# EAGLE schematic rgb_led_watch 2 (EAGLE 6.5.0)
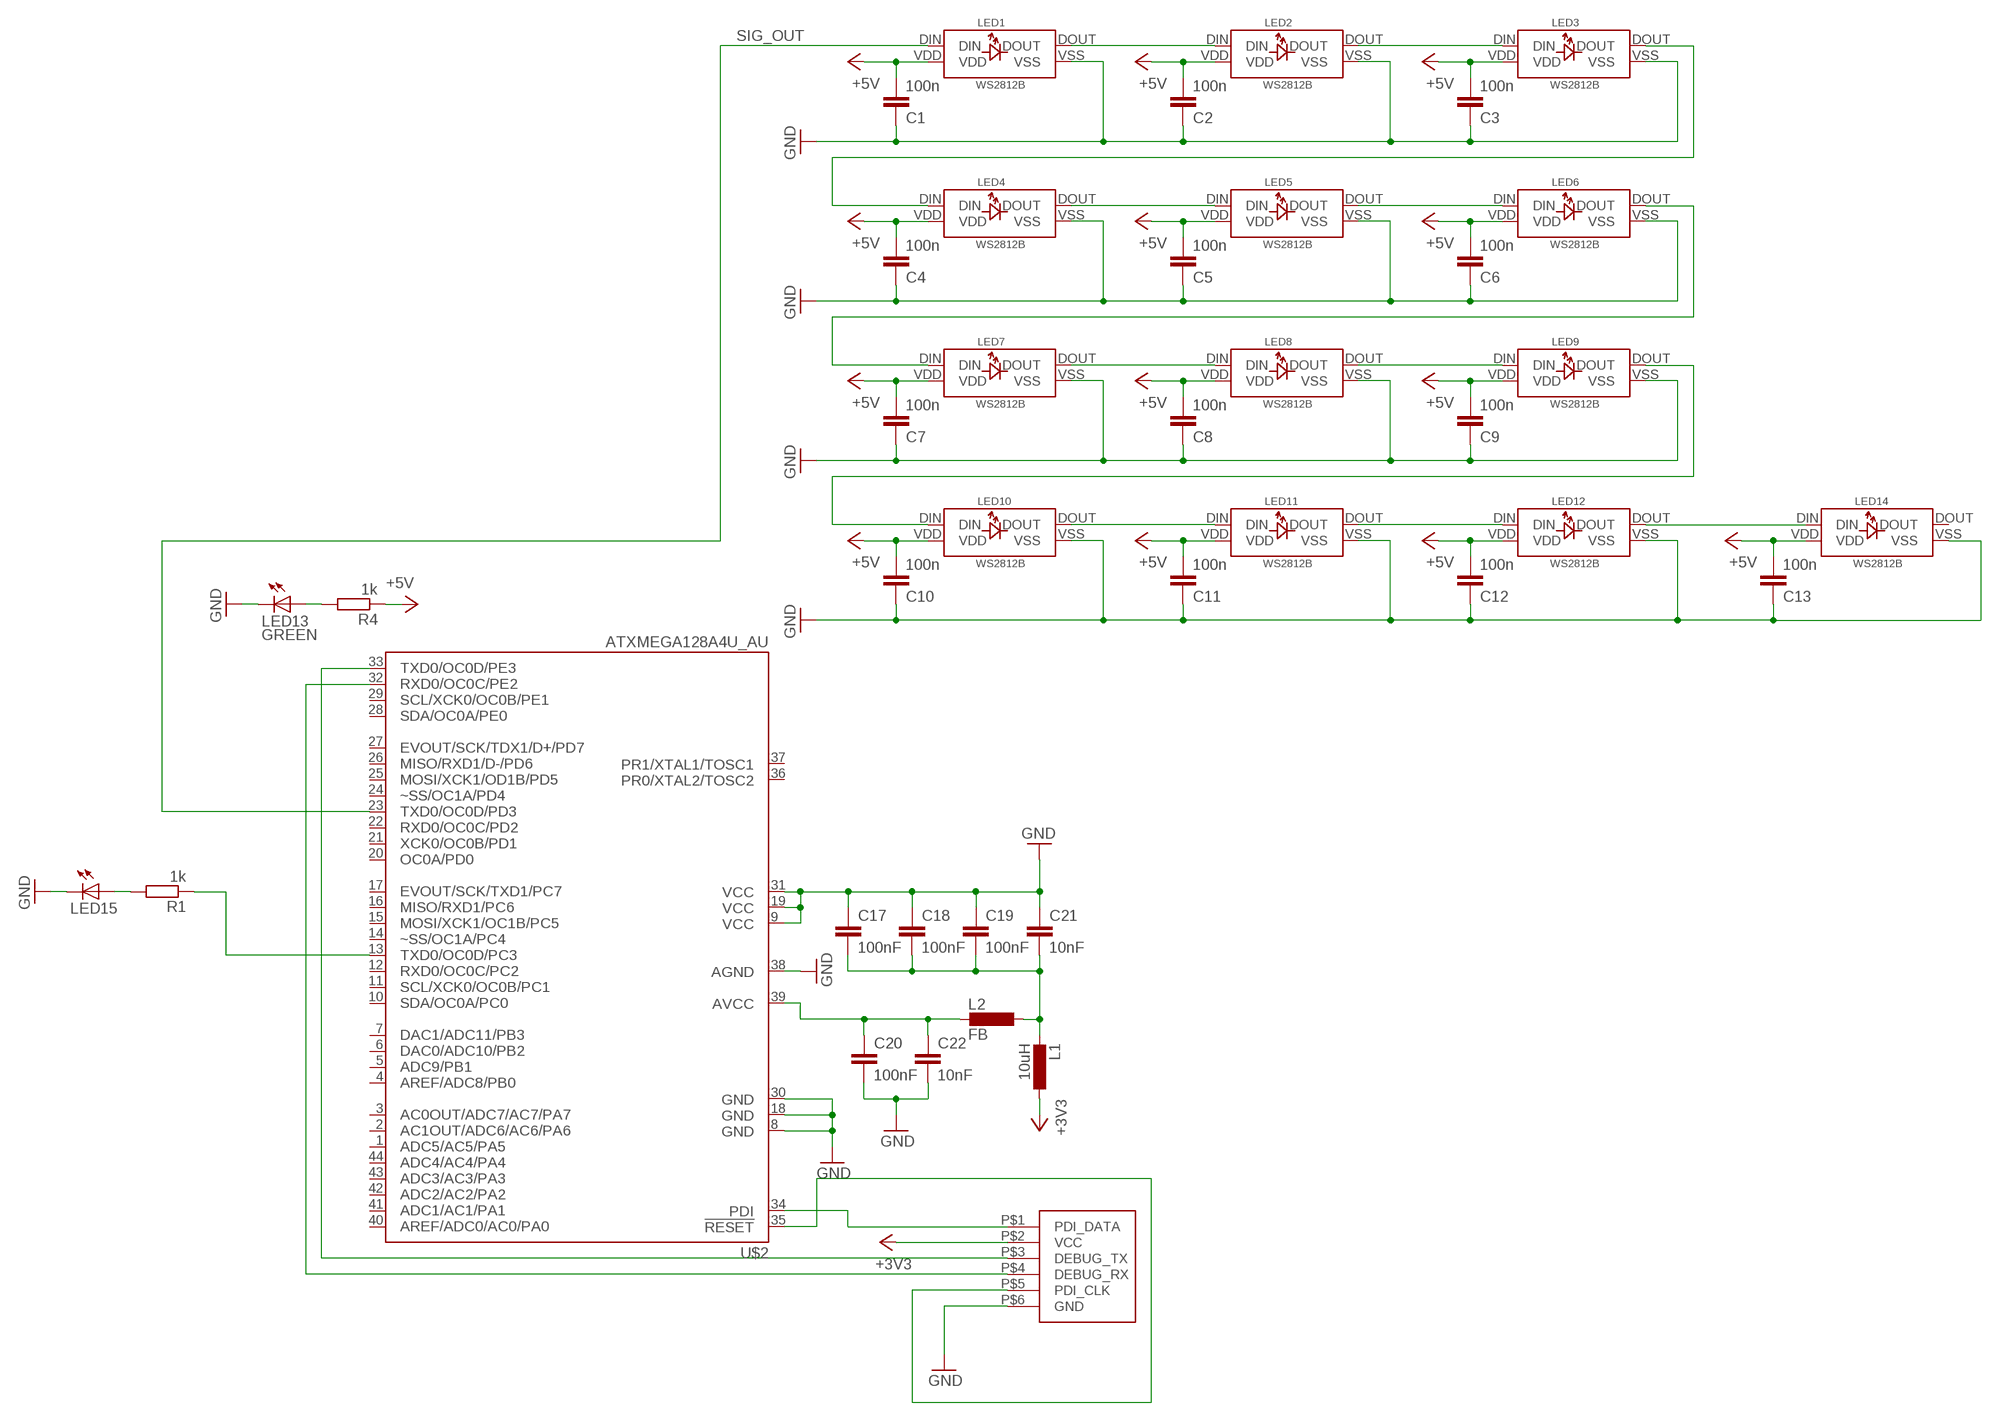
[diagram p0: schematic, sheet 1]

## Parts
C1  100n  C-EUC0603  [C0603]
C2  100n  C-EUC0603  [C0603]
C3  100n  C-EUC0603  [C0603]
C4  100n  C-EUC0603  [C0603]
C5  100n  C-EUC0603  [C0603]
C6  100n  C-EUC0603  [C0603]
C7  100n  C-EUC0603  [C0603]
C8  100n  C-EUC0603  [C0603]
C9  100n  C-EUC0603  [C0603]
C10  100n  C-EUC0603  [C0603]
C11  100n  C-EUC0603  [C0603]
C12  100n  C-EUC0603  [C0603]
C13  100n  C-EUC0603  [C0603]
C17  100nF  C-EUC0306  [C0306]
C18  100nF  C-EUC0306  [C0306]
C19  100nF  C-EUC0306  [C0306]
C20  100nF  C-EUC0306  [C0306]
C21  10nF  C-EUC0805  [C0805]
C22  10nF  C-EUC0805  [C0805]
L1  10uH  L-EUSMD0805  [R0805]
L2  FB  L-EUSMD0603  [R0603]
LED1  WS2812B  [WS2812B]
LED2  WS2812B  [WS2812B]
LED3  WS2812B  [WS2812B]
LED4  WS2812B  [WS2812B]
LED5  WS2812B  [WS2812B]
LED6  WS2812B  [WS2812B]
LED7  WS2812B  [WS2812B]
LED8  WS2812B  [WS2812B]
LED9  WS2812B  [WS2812B]
LED10  WS2812B  [WS2812B]
LED11  WS2812B  [WS2812B]
LED12  WS2812B  [WS2812B]
LED13  GREEN  LEDCHIPLED_0603  [CHIPLED_0603]
LED14  WS2812B  [WS2812B]
LED15  LED5MM  [LED5MM]
R1  1k  R-EU_R0603  [R0603]
R4  1k  R-EU_R0603  [R0603]
U$1  CON_PROG-6CORN  [SMD-6-CORNER]
U$2  ATXMEGA128A4U_AU  [TQFP44]

## Nets
+3V3: L1.1 U$1.P$2(VCC)
+5V: C1.2 C2.2 C3.2 C4.2 C5.2 C6.2 C7.2 C8.2 C9.2 C10.2 C11.2 C12.2 C13.2 LED1.VDD LED2.VDD LED3.VDD LED4.VDD LED5.VDD LED6.VDD LED7.VDD LED8.VDD LED9.VDD LED10.VDD LED11.VDD LED12.VDD LED14.VDD R4.1
GND: C1.1 C2.1 C3.1 C4.1 C5.1 C6.1 C7.1 C8.1 C9.1 C10.1 C11.1 C12.1 C13.1 C17.1 C18.1 C19.1 C20.2 C21.1 C22.2 LED1.VSS LED2.VSS LED3.VSS LED4.VSS LED5.VSS LED6.VSS LED7.VSS LED8.VSS LED9.VSS LED10.VSS LED11.VSS LED12.VSS LED13.C LED14.VSS LED15.K(C) U$1.P$6(GND) U$2.8(GND1) U$2.9(VCC1) U$2.18(GND2) U$2.19(VCC2) U$2.30(GND3) U$2.31(VCC3) U$2.38(AGND)
LED1: LED6.DOUT LED7.DIN
LED2: LED9.DOUT LED10.DIN
LED3: LED3.DOUT LED4.DIN
N$1: C17.2 C18.2 C19.2 C21.2 L1.2 L2.1
N$2: LED13.A R4.2
N$3: LED1.DOUT LED2.DIN
N$4: LED4.DOUT LED5.DIN
N$5: LED2.DOUT LED3.DIN
N$6: LED5.DOUT LED6.DIN
N$7: LED7.DOUT LED8.DIN
N$8: LED8.DOUT LED9.DIN
N$9: LED10.DOUT LED11.DIN
N$10: LED11.DOUT LED12.DIN
N$11: C20.1 C22.1 L2.2 U$2.39(AVCC)
N$12: U$1.P$1(PDI_DATA) U$2.34(PDI_DATA)
N$13: U$1.P$3(DEBUG_TX) U$2.33(PE3)
N$14: U$1.P$4(DEBUG_RX) U$2.32(PE2)
N$15: U$1.P$5(PDI_CLK) U$2.35(RESET)
N$16: LED12.DOUT LED14.DIN
N$18: LED15.A R1.2
N$19: R1.1 U$2.13(PC3)
SIG_OUT: LED1.DIN U$2.23(PD3)
Unconnected: LED14.DOUT U$2.1(PA5) U$2.2(PA6) U$2.3(PA7) U$2.4(PB0) U$2.5(PB1) U$2.6(PB2) U$2.7(PB3) U$2.10(PC0) U$2.11(PC1) U$2.12(PC2) U$2.14(PC4) U$2.15(PC5) U$2.16(PC6) U$2.17(PC7) U$2.20(PD0) U$2.21(PD1) U$2.22(PD2) U$2.24(PD4) U$2.25(PD5) U$2.26(PD6) U$2.27(PD7) U$2.28(PE0) U$2.29(PE1) U$2.36(PR0) U$2.37(PR1) U$2.40(PA0) U$2.41(PA1) U$2.42(PA2) U$2.43(PA3) U$2.44(PA4)

## Library data of the parts
C1-C13 = resistor:C-EU: CAPACITOR, European symbol
C17-C22 = rcl_upravena:C-EU: CAPACITOR, European symbol
L1 L2 = rcl_upravena:L-EU: INDUCTOR, European symbol
LED1-LED12 LED14 = rgb_led:WS2812B
LED13 LED15 = led:LED: LED OSRAM: - CHIPLED LG R971, LG N971, LY N971, LG Q971, LY Q971, LO R971, LY R971 LH N974, LH R974 LS Q976, LO Q976, LY Q976 LO Q996 - Hyper CHIPLED LW Q18S LB Q993, LB Q99A, LB R99A - SideLED LS A670, LO A670, LY A670, LG A670, LP A670 LB A673, LV A673, LT A673, LW A673 LH A674 LY A675 LS A676, LA A676, LO A676, LY A676, LW A676 LS A679, LY A679, LG A679 - Hyper Micro SIDELED® LS Y876, LA Y876, LO Y876, LY Y876 LT Y87S - SmartLED LW L88C, LW L88S LB L89C, LB L89S, LG L890 LS L89K, LO L89K, LY L89K LS L896, LA L896, LO L896, LY L896 - TOPLED LS T670, LO T670, LY T670, LG T670, LP T670 LSG T670, LSP T670, LSY T670, LOP T670, LYG T670 LG T671, LOG T671, LSG T671 LB T673, LV T673, LT T673, LW T673 LH T674 LS T676, LA T676, LO T676, LY T676, LB T676, LH T676, LSB T676, LW T676 LB T67C, LV T67C, LT T67C, LS T67K, LO T67K, LY T67K, LW E67C LS E67B, LA E67B, LO E67B, LY E67B, LB E67C, LV E67C, LT E67C LW T67C LS T679, LY T679, LG T679 LS T770, LO T770, LY T770, LG T770, LP T770 LB T773, LV T773, LT T773, LW T773 LH T774 LS E675, LA E675, LY E675, LS T675 LS T776, LA T776, LO T776, LY T776, LB T776 LHGB T686 LT T68C, LB T68C - Hyper Mini TOPLED® LB M676 - Mini TOPLED Santana® LG M470 LS M47K, LO M47K, LY M47K Source: http://www.osram.convergy.de LUXEON: - LUMILED® LXK2-PW12-R00, LXK2-PW12-S00, LXK2-PW14-U00, LXK2-PW14-V00 LXK2-PM12-R00, LXK2-PM12-S00, LXK2-PM14-U00 LXK2-PE12-Q00, LXK2-PE12-R00, LXK2-PE12-S00, LXK2-PE14-T00, LXK2-PE14-U00 LXK2-PB12-K00, LXK2-PB12-L00, LXK2-PB12-M00, LXK2-PB14-N00, LXK2-PB14-P00, LXK2-PB14-Q00 LXK2-PR12-L00, LXK2-PR12-M00, LXK2-PR14-Q00, LXK2-PR14-R00 LXK2-PD12-Q00, LXK2-PD12-R00, LXK2-PD12-S00 LXK2-PH12-R00, LXK2-PH12-S00 LXK2-PL12-P00, LXK2-PL12-Q00, LXK2-PL12-R00 Source: www.luxeon.com KINGBRIGHT: KA-3528ASYC Source: www.kingbright.com
R1 R4 = rcl_upravena:R-EU_: RESISTOR, European symbol
U$1 = con_prog:CON_PROG-6
U$2 = xmega:ATXMEGA*A4U_